# EAGLE design 12V Support (EAGLE 5.12)
PARTNO: CRA2512-FZ-R010ELF
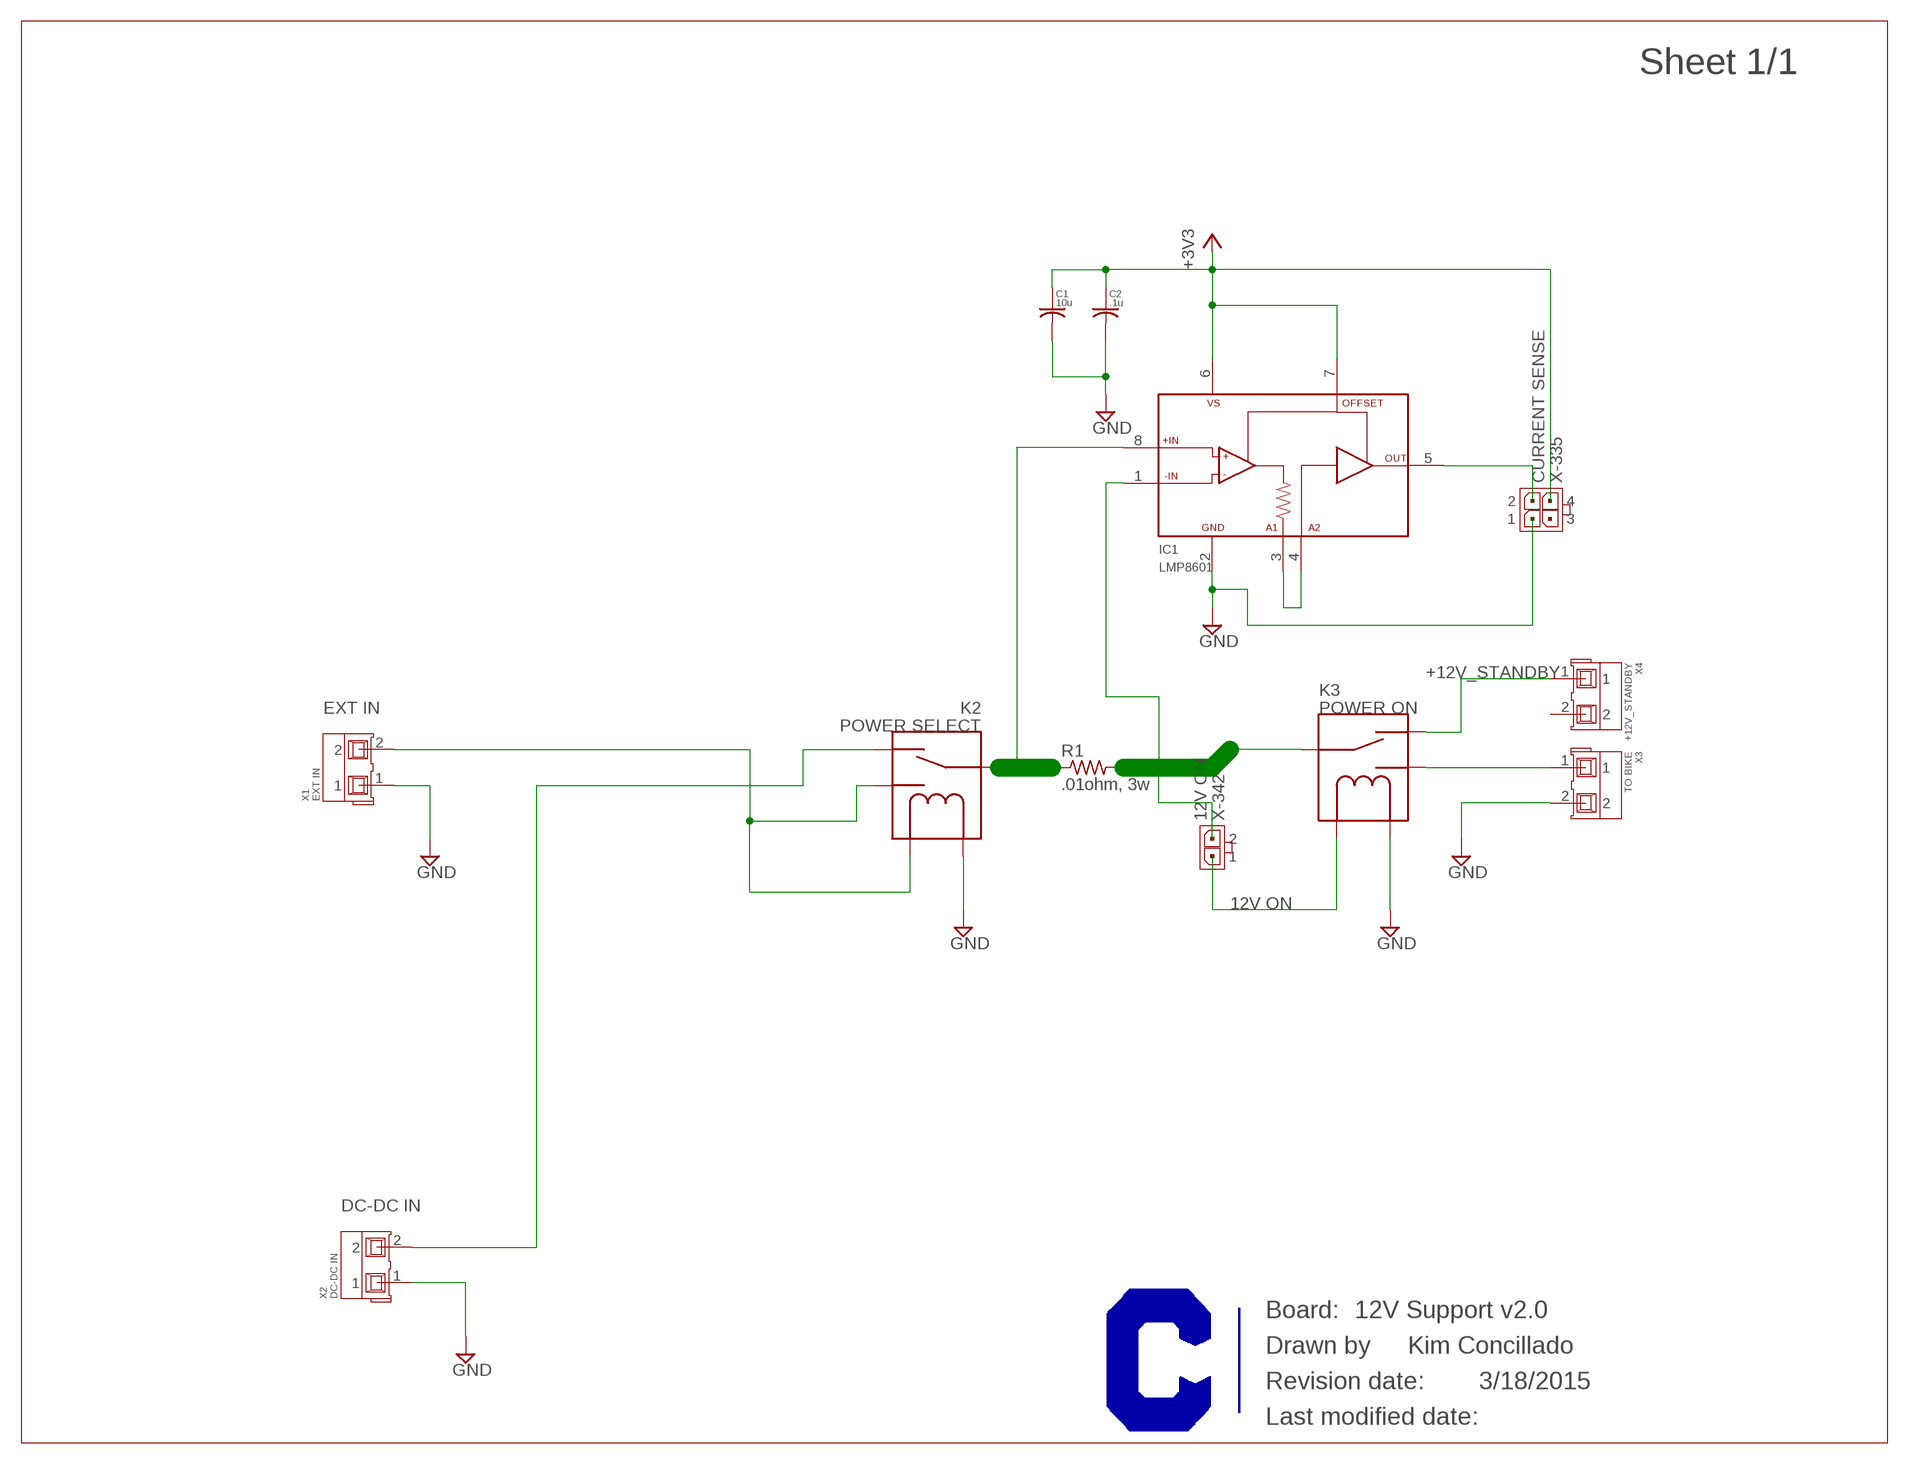
[diagram p0: schematic, sheet 1]

## Parts
C1  10u  C-USC0603  [C0603]
C2  .1u  C-USC0603  [C0603]
IC1  LMP8601  [SOIC8]
K2  POWER SELECT  JSM1-12V-5  [JSM1-12V-5]
K3  POWER ON  JSM1-12V-5  [JSM1-12V-5]
R1  .01ohm, 3w  R-US_R2512  [R2512]
U$1  CURRENT-C-LETTER-LANDSCAPE  [BLANK]
X1  EXT IN  TE-TERM_BLOCK-282836-2  [TERMINAL_BLOCK_282836-2]
X2  DC-DC IN  TE-TERM_BLOCK-282836-2  [TERMINAL_BLOCK_282836-2]
X3  TO BIKE  TE-TERM_BLOCK-282836-2  [TERMINAL_BLOCK_282836-2]
X4  +12V_STANDBY  TE-TERM_BLOCK-282836-2  [TERMINAL_BLOCK_282836-2]
X-335  CURRENT SENSE  MICROFIT-04-DUAL-RA-SMD-CLIP_RETENTION  [MICROFIT-4-DUAL-RA-SMD-CLIP_RETENTION]
X-342  12V ON  MICROFIT-02-SINGLE-RA-SMD  [MICROFIT-2-SINGLE-RA-SMD]

## Nets
12V-ON: K3.2(A2) X-342.1
+3V3: C1.1 C2.1 IC1.6(VS) IC1.7(OFFSET) X-335.4
+12V_STANDBY: K3.4(NC) X4.1
GND: C1.2 C2.2 IC1.2(GND) K2.2(A2) K3.5(A1) X1.1 X2.1 X3.2 X-335.1
N$1: K2.3(NO) K2.5(A1) X1.2
N$3: K2.4(NC) X2.2
N$4: IC1.3(A1) IC1.4(A2)
N$5: IC1.5(OUT) X-335.2
N$6: IC1.1(-IN) K3.1(C) R1.2 X-342.2
N$7: IC1.8(+IN) K2.1(C) R1.1
N$8: K3.3(NO) X3.1
Unconnected: X4.2 X-335.3

## Notes on the sheet
- EXT IN
- 12V ON
- DC-DC IN
- 12V Support v2.0
- Kim Concillado
- 3/18/2015

## Library data of the parts
C1 C2 = rcl:C-US: CAPACITOR, American symbol
IC1 = TI:LMP8601: LMP8601/LMP8601Q 60V Common Mode, Bidirectional Precision Current Sensing Amplifier Datasheet: http://www.ti.com/lit/ds/symlink/lmp8601.pdf Product page: http://www.ti.com/product/lmp8601 UPDATED 12/5/2012: Corrected SOIC8 pinout. Designs relying on this device before this revision will be incorrect and must be updated.
K2 K3 = Panasonic:JSM1-12V-5: JS-M Relay Datasheet: http://www.farnell.com/datasheets/98075.pdf; PARTNO: JSM1-12V-5
R1 = rcl:R-US_: RESISTOR, American symbol
U$1 = Frames:CURRENT-C-LETTER-LANDSCAPE; BOM: EXCLUDE
X1-X4 = TE:TE-TERM_BLOCK-282836-2
X-335 = Molex:MICROFIT-04-DUAL: Molex MicroFit 3.00mm Pitch Header, Surface Mount, Dual Row, 4 Circuits Molex P/N: 43045-0609 (vert) Drawing: http://www.molex.com/pdm_docs/sd/430450418_sd.pdf (vert) Information: http://www.molex.com/molex/products/datasheet.jsp?part=active/0430450418_PCB_HEADERS.xml (vert)
X-342 = Molex:MICROFIT-02-SINGLE: Molex MicroFit 3.00mm Pitch Header, Surface Mount, Dual Row, 4 Circuits Molex P/N: 43650-0212 (RA) Drawing: http://www.molex.com/pdm_docs/sd/436500212_sd.pdf (RA)

## Board
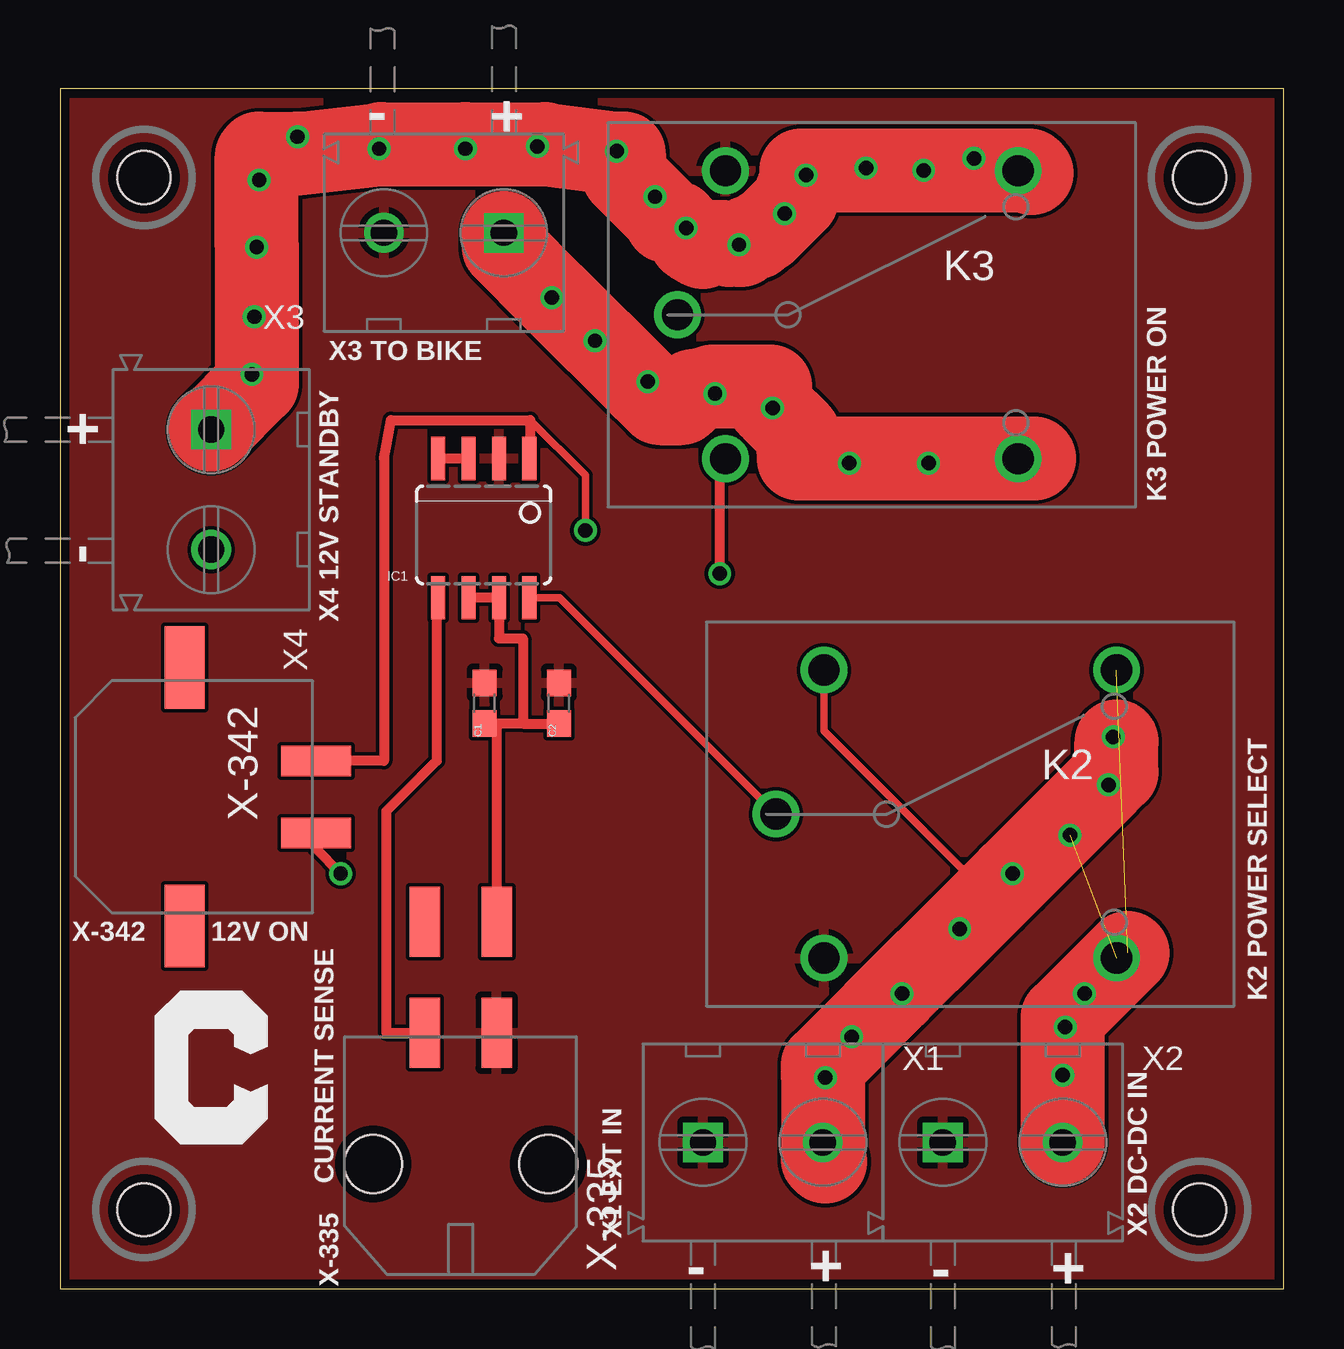
[diagram p1: board, top side]
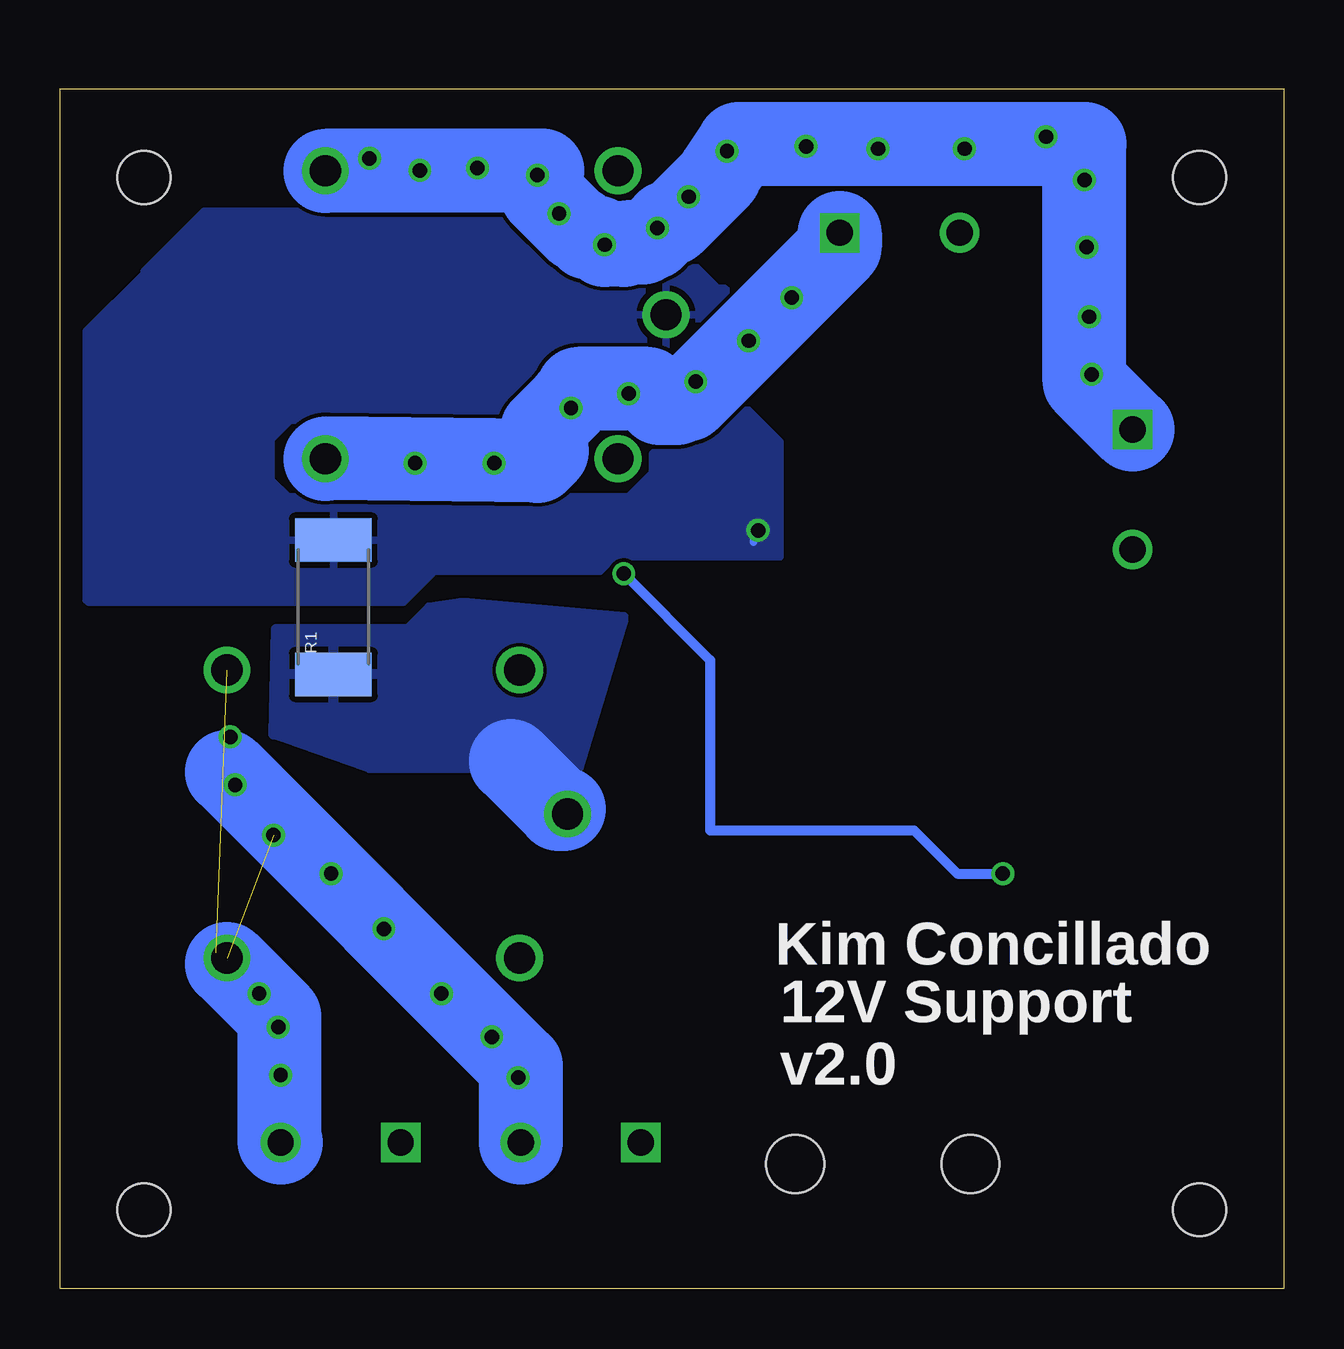
[diagram p2: board, bottom side, seen from below]

Size 51 x 50 mm. Coordinates in mm from the lower left corner, seen from the top.
Outline: 51,0 51,50 0,50 0,0 51,0
Copper layers (1*16): Top 0.0356mm / dielectric 1.5011mm / Bottom 0.0356mm
Design rules "OSH Park 2-layer": minimum track width 6mil, minimum drill 13mil, track to track 6mil, track to pad 6mil, pad to pad 6mil, via to via 6mil, smd to smd 6mil, copper to edge 15mil, drill to drill 6mil, minimum pad ring 7mil, minimum via ring 7mil, stop-mask expansion 4mil, vias tented up to drill 0mil, thermal gap 10mil
Holes 2.2 mm at 3.5,3.3 47.5,46.3 3.5,46.3 47.5,3.3

### Footprints (pad centres in the part's own frame; a part is rotated, then mirrored left to right if it is on the bottom)
C0603 = smd 1.1 x 1: 1 -0.85,0; 2 0.85,0
SOIC8 = smd 0.6 x 1.8: 1 0.23,-1.9; 2 1.5,-1.9; 3 2.77,-1.9; 4 4.04,-1.9; 5 4.04,3.9; 6 2.77,3.9; 7 1.5,3.9; 8 0.23,3.9
JSM1-12V-5 = drill 1.3 round: 1 -7.26,0.38; 2 -5.26,-5.62; 3 6.94,-5.62; 4 6.94,6.38; 5 -5.26,6.38
R2512 = smd 1.8 x 3.2: 1 -2.8,0; 2 2.8,0
TERMINAL_BLOCK_282836-2 = drill 1.1 square: 1 -2.5,0 | drill 1.1 round: 2 2.5,0
MICROFIT-4-DUAL-RA-SMD-CLIP_RETENTION = smd 1.27 x 2.921: 1 1.5,5.47; 2 -1.5,5.47; 3 -1.5,10.1; 4 1.5,10.1 | hole 2.413: 3.65,0; -3.65,0
MICROFIT-2-SINGLE-RA-SMD = smd 1.27 x 2.921: 1 1.5,5.474; 2 -1.5,5.474 | smd 3.429 x 1.651: NC@1 -5.385,0; NC@2 5.385,0

### Placement (x,y rotation side)
C1  17.7,24.4 90 top
C2  20.8,24.4 90 top
IC1  19.8,32.7 180 top
K2  37.1,19.4 0 top
K3  33,40.2 0 top
R1  39.6,28.4 90 bottom
U$1  -23.49,71.02 0 top  (outside the outline)
U$2  [CURRENT-0.25"]  4,6.1 0 top
X1  29.3,6.1 0 top
X2  39.3,6.1 0 top
X3  16,44 180 top
X4  6.3,33.3 270 top
X-335  16.7,5.2 0 top
X-342  5.2,20.5 270 top

### Tracks (layer width: path | path; a pad name or v marks a point on that pad's centre or on a via)
12V-ON  (via drill 0.6)
  Top 0.406: X-342.1 10.67,18.33 v11.7,17.3 | v27.5,29.8 27.5,34.34 K3.2
  Bottom 0.406: v11.7,17.3 13.6,17.3 15.4,19.1 23.9,19.1 23.9,26.2 v27.5,29.8
+3V3
  Top 0.406: 19.3,23.55 C2.1 | 19.3,23.55 C1.1 18.2,23.55 X-335.4 | IC1.6 IC1.7 18.3,27.1 19.3,27.1 19.3,23.55
+12V_STANDBY  (via drill 0.6)
  Top 0.406: v8,38.1 8.1,38.1 8.2,38.2 | v8.1,40.5 8.1,40.3 8.3,40.1 8.3,43.3 v8.2,43.4 | 8.3,44.9 v8.3,46.2 8.3,46.3 8.2,46.4 | 9.9,47.3 v9.9,48 | 13.4,47.7 v13.3,47.5 | 16.9,47.4 v16.9,47.5 16.9,47.7 | v19.9,47.6 19.9,47.5 20.2,47.7 | 23.3,47.3 v23.2,47.4 | v24.8,45.5 24.6,45.5 24.5,45.4 | 25.8,44.3 v26.1,44.2 | v30.2,44.8 29.6,44.8 v28.3,43.5 | 33.6,46.6 v33.6,46.7 | v38.1,47.1 38.1,46.1 38,46 40,46 40.5,46.5
  Top 3.5: X4.1 8.2,37.7 8.2,38.2 v8.2,43.4 8.2,46.4 8.2,47.2 8.3,47.3 9.9,47.3 13.4,47.7 16.9,47.7 20.2,47.7 23.3,47.3 23.5,47.3 23.5,46.4 24.5,45.4 25.3,44.6 25.3,44.5 25.7,44.4 25.8,44.3 26.1,44 26.3,43.7 26.8,43.4 26.6,43.7 27.1,43.6 | 27.1,43.6 27.8,43.6 27.9,43.5 v28.3,43.5 28.4,43.5 28.7,43.8 29,43.8 29.3,44.1 29.4,44.1 30.7,45.4 30.7,45.7 31.1,46.1 v31.1,46.4 30.9,46.6 33.6,46.6 v36,46.6 40.4,46.6 40.5,46.5 | 27.1,43.6 26.8,43.6
  Bottom 3.5: 30.9,46.58 K3.4 | 30.9,46.58 30.9,46.6 | 30.9,46.58 30.9,45.6 29.45,44.15 29.35,44.15 29,43.8 28.6,43.8 v28.3,43.5 27.5,43.5 27.4,43.6 26.7,43.6 26.3,43.8 25.7,44.4 25.5,44.4 23.5,46.4 23.5,46.5 22.7,47.7 8.3,47.7 8.3,37.8 X4.1
GND
  pour Top (rank 3): 0,0 0,50 51,50 51,0
N$1  (via drill 0.6)  (2 unrouted)
  Top 0.305: K2.5 31.84,23.26 38.8,16.3 | v43.9,23 43.9,22.94 44.04,22.8 | v42.1,18.9 43.7,20.5 v43.7,21 43.5,21 43.25,20.75 | v39.7,17.3 39.7,17.2 39.65,17.15 | v35.1,12.3 34.9,12.3 34.85,12.35 | 31.8,8.9 v31.9,8.8
  Top 3.5: 44.04,22.8 44.04,21.54 43.25,20.75 39.65,17.15 38.8,16.3 v37.5,15 34.85,12.35 v33,10.5 31.8,9.3 31.8,8.9 31.8,5.4 31.9,5.3
  Bottom 3.5: X1.2 31.8,9.3 44.04,21.54
N$3  (via drill 0.6)  (1 unrouted)
  Top 0.406: 41.8,8.8 41.85,8.85 41.85,8.9 v41.8,8.9 41.9,9 v41.9,10.9 | v42.7,12.3 42.8,12.3 44.5,14
  Top 3.5: X2.2 41.8,8.8 v41.8,8.9 41.8,11.3 44.5,14
  Bottom 3.5: 44.04,13.54 41.85,11.35 41.85,6.15 X2.2
N$4
  Top 0.406: IC1.4 IC1.3
N$5
  Top 0.406: X-335.2 13.6,10.67 13.6,19.9 15.7,22 15.7,28.74 IC1.5
N$6  (via drill 0.6)
  Top 0.305: 19.6,36.2 21.9,33.9 v21.9,31.6
  Top 0.406: X-342.2 13.5,22 13.5,34.6 13.8,36.2 19.6,36.2 19.6,34.63 IC1.1
  Bottom 0.305: v21.9,31.6 22.1,31.4 22.1,31.1
  pour Bottom: 23.3,41.7 23.6,41.7 24.8,42.9 30.2,42.9 32.2,44.9 45,44.9 47.5,42.4 47.5,42.3 49.9,39.9 49.9,28.7 49.8,28.6 36.7,28.6 35.4,29.9 28.5,29.9 27.9,30.5 21,30.5 21,35.3 22.5,36.8 23.1,36.8 24.8,35.1 26,35.1 26.3,34.8 26.3,34 27.3,33 41.5,33 42.2,33.7 42.2,35.4 41.4,36.2 32.6,36.2 30.4,38.4 29.8,39 25.3,39 25.2,38.9 25.2,39 23.2,41 23.2,41.6
N$7
  Top 0.305: IC1.8 20.82,28.8 K2.1
  Bottom 0.305: 30,20 30,19.94 K2.1
  Bottom 3.5: 30,20 30.2,20 32.2,22
  pour Bottom: 36.5,27.5 35.6,28.4 34.2,28.6 27.5,28 29.4,21.7 38.1,21.7 42.1,23.1 42,27.5
N$8  (via drill 0.6)
  Top 0.406: v36.2,34.4 36.2,34.5 36.1,34.6 | v32.9,34.4 32.9,34.5 33,34.6 | v27.3,37.3 27.2,37.2 27.2,37.6 | 24.3,37.6 v24.5,37.8 22.8,39.5 v22.3,39.5 | 20.6,41.3 v20.5,41.3
  Top 3.5: X3.1 18.5,43.4 20.6,41.3 24.3,37.6 25,36.9 25.9,36.9 26.4,37.4 27.2,37.6 29.6,37.6 29.5,37.3 29.5,36.9 v29.7,36.7 30.8,35.6 30.7,35.4 30.8,34.6 33,34.6 36.1,34.6 40.6,34.6
  Bottom 3.5: K3.3 39.92,34.6 31.1,34.5 30.7,34.9 30.9,35.8 29.9,36.8 29.5,37.3 29.4,37.5 26.5,37.5 26,36.9 25.3,36.9 25.15,37.05 24.85,37.05 18.5,43.4 X3.1

### Text on the board
tPlace: - | + | X3 TO BIKE | + | K3 POWER ON | - | X4 12V STANDBY | X-342 | 12V ON | K2 POWER SELECT | CURRENT SENSE | X1 EXT IN | X2 DC-DC IN | X-335 | - | + | - | +
bNames: Kim Concillado | 12V Support | v2.0